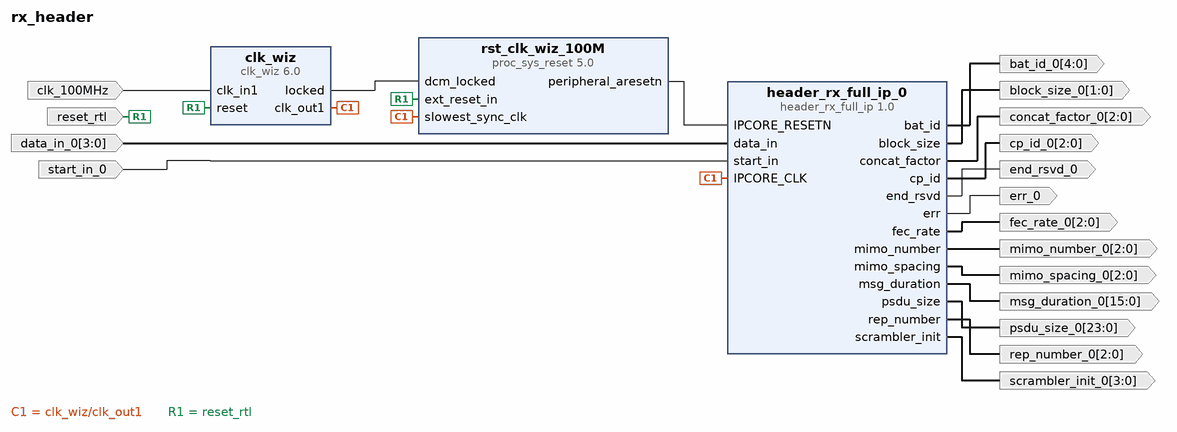
[diagram p0: block diagram of the top level]
# Vivado block design rx_header, xc7z010clg400-1, Vivado 2023.2
create_bd_design rx_header

create_bd_port -dir I -type clk clk_100MHz
set_property -dict {CONFIG.FREQ_HZ 125000000} [get_bd_ports clk_100MHz]
create_bd_port -dir I -type rst reset_rtl
set_property -dict {CONFIG.POLARITY ACTIVE_HIGH} [get_bd_ports reset_rtl]
create_bd_port -dir O -from 4 -to 0 bat_id_0
create_bd_port -dir O -from 1 -to 0 block_size_0
create_bd_port -dir O -from 2 -to 0 concat_factor_0
create_bd_port -dir O -from 2 -to 0 cp_id_0
create_bd_port -dir I -from 3 -to 0 data_in_0
create_bd_port -dir O end_rsvd_0
create_bd_port -dir O err_0
create_bd_port -dir O -from 2 -to 0 fec_rate_0
create_bd_port -dir O -from 2 -to 0 mimo_number_0
create_bd_port -dir O -from 2 -to 0 mimo_spacing_0
create_bd_port -dir O -from 15 -to 0 msg_duration_0
create_bd_port -dir O -from 23 -to 0 psdu_size_0
create_bd_port -dir O -from 2 -to 0 rep_number_0
create_bd_port -dir O -from 3 -to 0 scrambler_init_0
create_bd_port -dir I start_in_0

create_bd_cell -type ip -vlnv user.org:ip:header_rx_full_ip:1.0 header_rx_full_ip_0
create_bd_cell -type ip -vlnv xilinx.com:ip:clk_wiz:6.0 clk_wiz
set_property -dict [list \
  CONFIG.CLKIN1_JITTER_PS 80.0 \
  CONFIG.CLKOUT1_JITTER 119.348 \
  CONFIG.CLKOUT1_PHASE_ERROR 96.948 \
  CONFIG.CLKOUT1_REQUESTED_OUT_FREQ 125.000 \
  CONFIG.MMCM_CLKFBOUT_MULT_F 8.000 \
  CONFIG.MMCM_CLKIN1_PERIOD 8.000 \
  CONFIG.MMCM_CLKOUT0_DIVIDE_F 8.000 \
  CONFIG.PRIM_IN_FREQ 125.000 \
] [get_bd_cells clk_wiz]
create_bd_cell -type ip -vlnv xilinx.com:ip:proc_sys_reset:5.0 rst_clk_wiz_100M

# ---- connections ----

connect_bd_net [get_bd_ports clk_100MHz] [get_bd_pins clk_wiz/clk_in1]
connect_bd_net [get_bd_pins clk_wiz/clk_out1] [get_bd_pins rst_clk_wiz_100M/slowest_sync_clk] [get_bd_pins header_rx_full_ip_0/IPCORE_CLK]
connect_bd_net [get_bd_pins clk_wiz/locked] [get_bd_pins rst_clk_wiz_100M/dcm_locked]
connect_bd_net -net data_in_0_1 [get_bd_ports data_in_0] [get_bd_pins header_rx_full_ip_0/data_in]
connect_bd_net [get_bd_pins header_rx_full_ip_0/bat_id] [get_bd_ports bat_id_0]
connect_bd_net [get_bd_pins header_rx_full_ip_0/block_size] [get_bd_ports block_size_0]
connect_bd_net [get_bd_pins header_rx_full_ip_0/concat_factor] [get_bd_ports concat_factor_0]
connect_bd_net [get_bd_pins header_rx_full_ip_0/cp_id] [get_bd_ports cp_id_0]
connect_bd_net [get_bd_pins header_rx_full_ip_0/end_rsvd] [get_bd_ports end_rsvd_0]
connect_bd_net [get_bd_pins header_rx_full_ip_0/err] [get_bd_ports err_0]
connect_bd_net [get_bd_pins header_rx_full_ip_0/fec_rate] [get_bd_ports fec_rate_0]
connect_bd_net [get_bd_pins header_rx_full_ip_0/mimo_number] [get_bd_ports mimo_number_0]
connect_bd_net [get_bd_pins header_rx_full_ip_0/mimo_spacing] [get_bd_ports mimo_spacing_0]
connect_bd_net [get_bd_pins header_rx_full_ip_0/msg_duration] [get_bd_ports msg_duration_0]
connect_bd_net [get_bd_pins header_rx_full_ip_0/psdu_size] [get_bd_ports psdu_size_0]
connect_bd_net [get_bd_pins header_rx_full_ip_0/rep_number] [get_bd_ports rep_number_0]
connect_bd_net [get_bd_pins header_rx_full_ip_0/scrambler_init] [get_bd_ports scrambler_init_0]
connect_bd_net [get_bd_ports reset_rtl] [get_bd_pins clk_wiz/reset] [get_bd_pins rst_clk_wiz_100M/ext_reset_in]
connect_bd_net [get_bd_pins rst_clk_wiz_100M/peripheral_aresetn] [get_bd_pins header_rx_full_ip_0/IPCORE_RESETN]
connect_bd_net -net start_in_0_1 [get_bd_ports start_in_0] [get_bd_pins header_rx_full_ip_0/start_in]

validate_bd_design
save_bd_design
